# Altium schematic sheet Controlled Voltage Gain.SchDoc
size A4
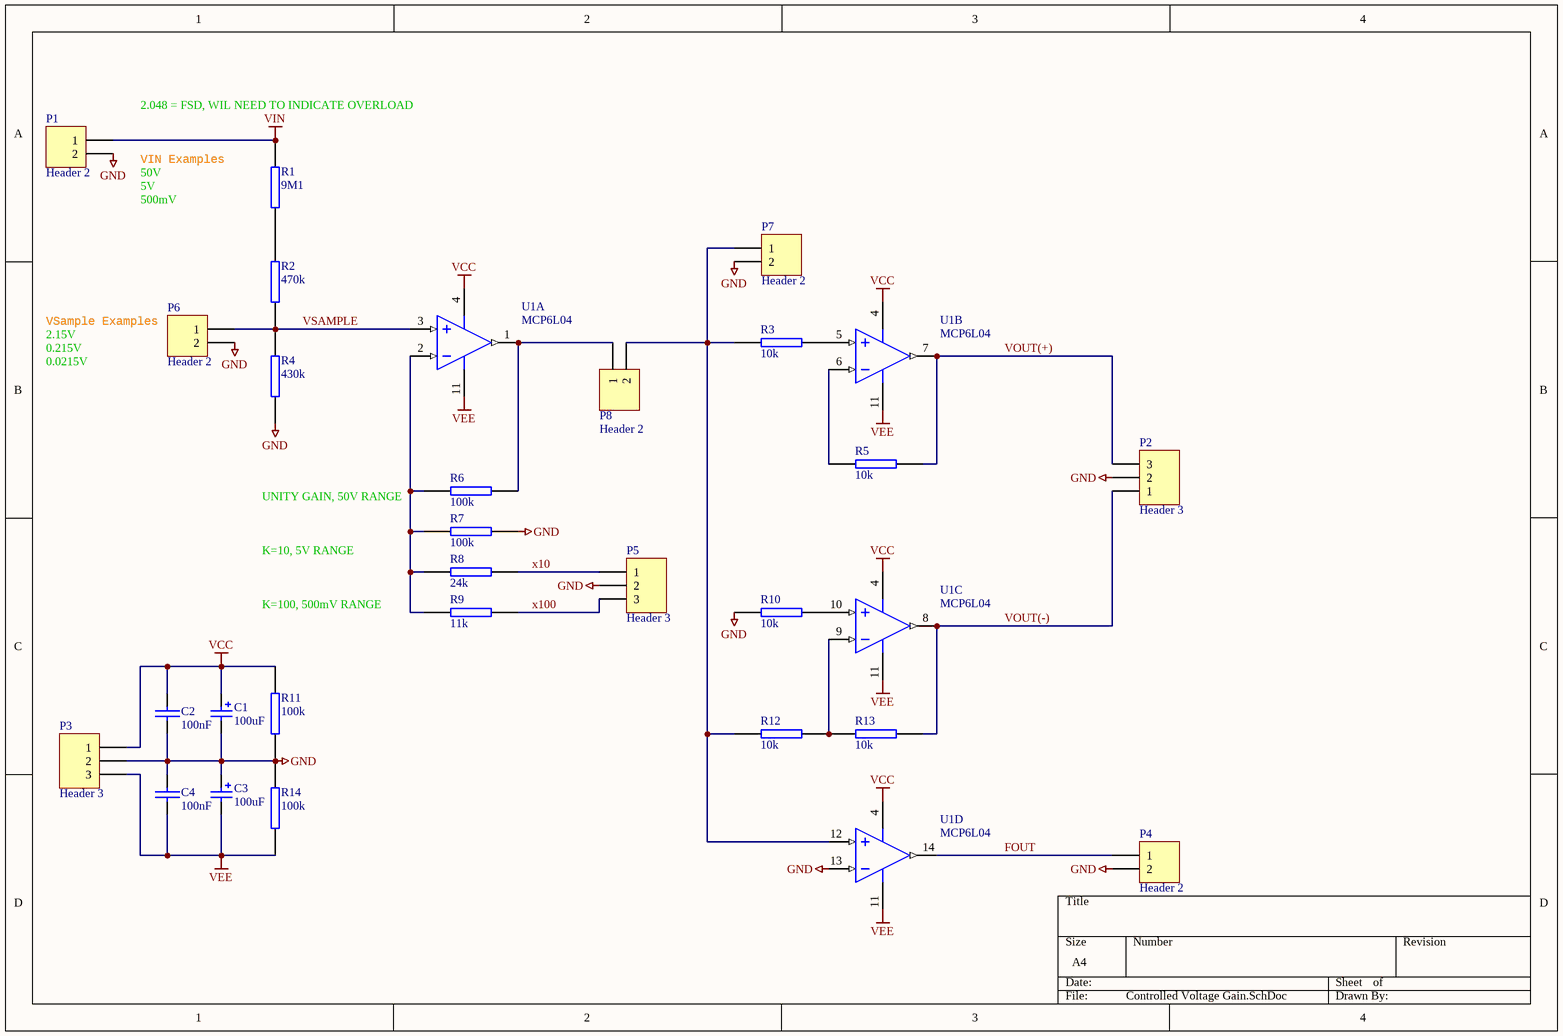
[diagram p0: Controlled Voltage Gain.SchDoc]

## Parts
C1  100uF  [RB5-10.5]
C2  100nF  [CAP (3D) - 0603]
C3  100uF  [RB5-10.5]
C4  100nF  [CAP (3D) - 0603]
P1  Header 2  [HDR1X2]
P2  Header 3  [HDR1X3]
P3  Header 3  [HDR1X3]
P4  Header 2  [HDR1X2]
P5  Header 3  [HDR1X3]
P6  Header 2  [HDR1X2]
P7  Header 2  [HDR1X2]
P8  Header 2  [HDR1X2]
R1  9M1  [RES (3D) - 0603]
R2  470k  [RES (3D) - 0603]
R3  10k  [RES (3D) - 0603]
R4  430k  [RES (3D) - 0603]
R5  10k  [RES (3D) - 0603]
R6  100k  [RES (3D) - 0603]
R7  100k  [RES (3D) - 0603]
R8  24k  [RES (3D) - 0603]
R9  11k  [RES (3D) - 0603]
R10  10k  [RES (3D) - 0603]
R11  100k  [RES (3D) - 0603]
R12  10k  [RES (3D) - 0603]
R13  10k  [RES (3D) - 0603]
R14  100k  [RES (3D) - 0603]
U1  MCP6L04  [SO-14]  (parts A,B,C,D of 4)

## Nets
GND: C1.2 C2.2 C3.1 C4.1 P1.2 P2.2 P3.2 P4.2 P5.2 P6.2 P7.2 R4.2 R7.1 R10.1 R11.1 R14.2 U1.13(INC-)
VCC: C1.1 C2.1 P3.1 R11.2 U1.4(VDD)
VEE: C3.2 C4.2 P3.3 R14.1 U1.11(VSS)
VIN: P1.1 R1.2
FOUT: P4.1 U1.14(OUTD)
VOUT(+): P2.3 R5.2 U1.7(OUTB)
VOUT(-): P2.1 R13.2 U1.8(OUTC)
VSAMPLE: P6.1 R2.2 R4.1 U1.3(INA+)
x10: P5.1 R8.1
x100: P5.3 R9.1
NetP7_1: P7.1 P8.2 R3.1 R12.1 U1.12(INC+)
NetP8_1: P8.1 R6.1 U1.1(OUTA)
NetR1_1: R1.1 R2.1
NetR3_2: R3.2 U1.5(INB+)
NetR5_1: R5.1 U1.6(INB-)
NetR6_2: R6.2 R7.2 R8.2 R9.2 U1.2(INA-)
NetR10_2: R10.2 U1.10(INC+)
NetR12_2: R12.2 R13.1 U1.9(INC-)

## Notes on the sheet
- 2.048 = FSD, WIL NEED TO INDICATE OVERLOAD
- 50V
- VIN Examples
- 5V
- 500mV
- 2.15V
- 0.215V
- VSample Examples
- 0.0215V
- UNITY GAIN, 50V RANGE
- K=10, 5V RANGE
- K=100, 500mV RANGE

## Library data of the parts
C1 C3 = Cap Pol: CAPACITOR POLARISED TAG B CASE; Manufacturer: Generic Components; Manufacturer Part No.: 293D106X9020B8T; value: 100uF; Mouser Part no.: 74-293D106X9020B8T; Web link: http://au.mouser.com/ProductDetail/Vishay-Sprague/293D106X9020B8T/?qs=sGAEpiMZZMukHu%252bjC5l7YZW4AlqROhXN47lkpjjQgHw%3d
C2 C4 = CAP: CAPACITOR SMD 0603; Manufacturer: Murata; Manufacturer Part No.: GCM188R71C104KA37D; value: 100nF; Mouser Part no.: 81-GCM188R71C104KA7D; Web link: http://au.mouser.com/ProductDetail/Murata/GCM188R71C104KA37D/?qs=aEuGZpxfbxWKAxwYn%252beTMg%3d%3d
P1 P4 P6-P8 = Header 2: Header, 2-Pin; LatestRevisionDate: 17-Jul-2002; LatestRevisionNote: Re-released for DXP Platform.; Publisher: Altium Limited
P2 P3 P5 = Header 3: Header, 3-Pin; LatestRevisionDate: 17-Jul-2002; LatestRevisionNote: Re-released for DXP Platform.; Publisher: Altium Limited
R1 = RES SMD 0603 10k: RESISTOR SMD 0603 10k; Manufacturer: Vishay/Dale; Manufacturer Part No.: CRCW06038M06FKEA; Mouser Part no.: 71-CRCW0603-8.06M-E3; Web link: http://au.mouser.com/ProductDetail/Vishay/CRCW06038M06FKEA/?qs=y%252bMD5VLd6nuCUjzPeM%2fNuA%3d%3d; value: 9M1
R2 R4 = RES SMD 0603 10k: RESISTOR SMD 0603 10k; Manufacturer: 71-CRCW0603-1.62M-E3; Manufacturer Part No.: CRCW06031M62FKEA; Mouser Part no.: Vishay/Dale; Web link: http://au.mouser.com/ProductDetail/Vishay-Dale/CRCW06031M62FKEA/?qs=T8SocJY5PJGlLyODpclhGBx5u7VrWxQmuiInBv9Pchc%3d
  R2: value: 470k
  R4: value: 430k
R3 R5-R14 = RES SMD 0603 10k: RESISTOR SMD 0603 10k; Manufacturer: Bourns; Manufacturer Part No.: CR0603FX-1002ELF; Mouser Part no.: 652-CR0603FX-1002ELF; Web link: http://au.mouser.com/Search/Refine.aspx?Keyword=652-CR0603FX-1002ELF
  R3 R5 R10 R12 R13: value: 10k
  R6 R7 R11 R14: value: 100k
  R8: value: 24k
  R9: value: 11k
U1 = MCP6L04: Value: MCP6L04